# Altium project st-link-v2.PrjPCB
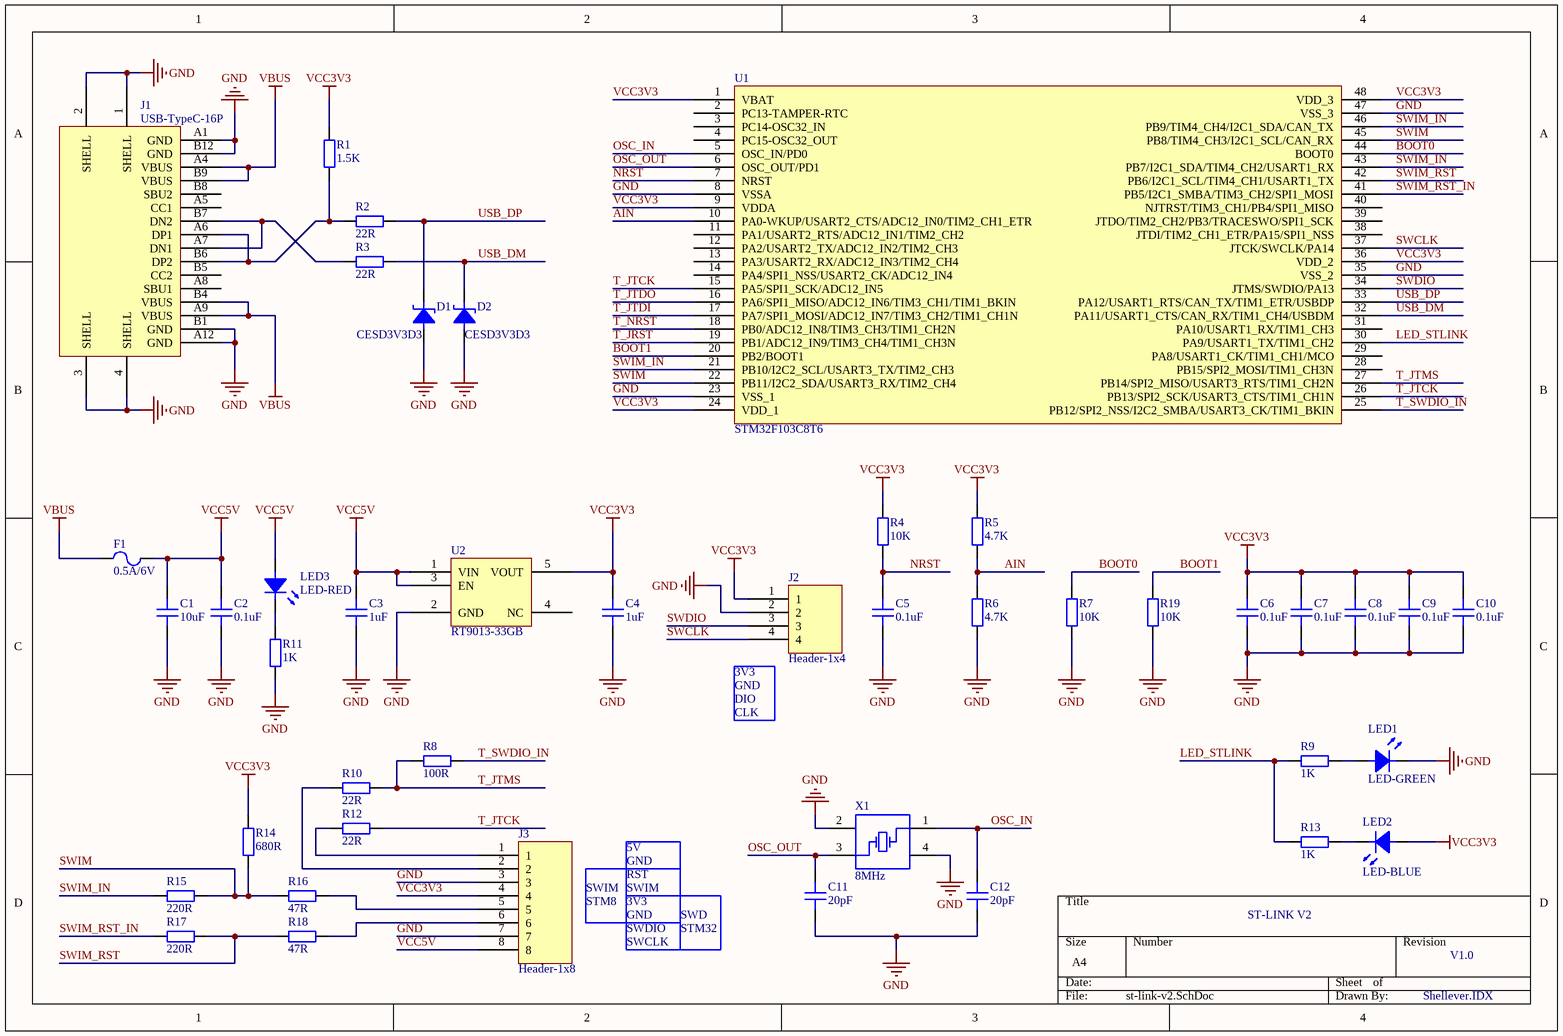
[diagram p0: st-link-v2.SchDoc]
1 sheet, 43 parts. Net scope: global (net labels, ports and power ports of the same name join across sheets).
Board file: st-link-v2.PcbDoc

## Sheet st-link-v2.SchDoc: ST-LINK V2
size A4; DrawnBy: Shellever.IDX; Revision: V1.0

### Parts
C1  10uF  [0603C]
C2  0.1uF  [0603C]
C3  1uF  [0603C]
C4  1uF  [0603C]
C5  0.1uF  [0603C]
C6  0.1uF  [0603C]
C7  0.1uF  [0603C]
C8  0.1uF  [0603C]
C9  0.1uF  [0603C]
C10  0.1uF  [0603C]
C11  20pF  [0603C]
C12  20pF  [0603C]
D1  CESD3V3D3  [SOD-323_L1.8-W1.3-LS2.5-RD]
D2  CESD3V3D3  [SOD-323_L1.8-W1.3-LS2.5-RD]
F1  0.5A/6V  [0603F]
J1  USB-TypeC-16P  [USB-C-SMD_KH-TYPE-C-16P]
J2  Header-1x4  [HDR-TH_4P-P2.54-V-M]
J3  Header-1x8  [HDR-TH_8P-P2.54-V-M]
LED1  LED-GREEN  [0603LED]
LED2  LED-BLUE  [0603LED]
LED3  LED-RED  [0603LED]
R1  1.5K  [0603R]
R2  22R  [0603R]
R3  22R  [0603R]
R4  10K  [0603R]
R5  4.7K  [0603R]
R6  4.7K  [0603R]
R7  10K  [0603R]
R8  100R  [0603R]
R9  1K  [0603R]
R10  22R  [0603R]
R11  1K  [0603R]
R12  22R  [0603R]
R13  1K  [0603R]
R14  680R  [0603R]
R15  220R  [0603R]
R16  47R  [0603R]
R17  220R  [0603R]
R18  47R  [0603R]
R19  10K  [0603R]
U1  STM32F103C8T6  [LQFP-48_L7.0-W7.0-P0.50-LS9.0-BL]
U2  RT9013-33GB  [SOT-23-5_L3.0-W1.7-P0.95-LS2.8-BR]
X1  8MHz  [OSC-SMD_3225-4P-L3.2-W2.5-BL]

### Nets
GND: C1.1 C2.1 C3.1 C4.1 C5.1 C6.1 C7.1 C8.1 C9.1 C10.1 C11.2 C12.1 D1.2(A) D2.2(A) J1.1(SHELL) J1.2(SHELL) J1.3(SHELL) J1.4(SHELL) J1.A1(GND) J1.A12(GND) J1.B1(GND) J1.B12(GND) J2.2 J3.3 J3.7 LED1.2(K) R6.1 R7.1 R11.1 R19.1 U1.8(VSSA) U1.23(VSS_1) U1.35(VSS_2) U1.47(VSS_3) U2.2(GND) X1.2(GND) X1.4(GND)
VBUS: F1.1 J1.A4(VBUS) J1.A9(VBUS) J1.B4(VBUS) J1.B9(VBUS)
VCC3V3: C4.2 C6.2 C7.2 C8.2 C9.2 C10.2 J2.1 J3.4 LED2.1(A) R1.2 R4.2 R5.2 R14.2 U1.1(VBAT) U1.9(VDDA) U1.24(VDD_1) U1.36(VDD_2) U1.48(VDD_3) U2.5(VOUT)
VCC5V: C1.2 C2.2 C3.2 F1.2 J3.8 LED3.1(A) U2.1(VIN) U2.3(EN)
AIN: R5.1 R6.2 U1.10(PA0-WKUP/USART2_CTS/ADC12_IN0/TIM2_CH1_ETR)
BOOT0: R7.2 U1.44(BOOT0)
BOOT1: R19.2 U1.20(PB2/BOOT1)
LED_STLINK: R9.2 R13.2 U1.30(PA9/USART1_TX/TIM1_CH2)
NRST: C5.2 R4.1 U1.7(NRST)
OSC_IN: C12.2 U1.5(OSC_IN/PD0) X1.1(OSC1)
OSC_OUT: C11.1 U1.6(OSC_OUT/PD1) X1.3(OSC2)
SWCLK: J2.4 U1.37(JTCK/SWCLK/PA14)
SWDIO: J2.3 U1.34(JTMS/SWDIO/PA13)
SWIM: R14.1 R15.1 R16.2 U1.22(PB11/I2C2_SDA/USART3_RX/TIM2_CH4) U1.45(PB8/TIM4_CH3/I2C1_SCL/CAN_RX)
SWIM_IN: R15.2 U1.21(PB10/I2C2_SCL/USART3_TX/TIM2_CH3) U1.43(PB7/I2C1_SDA/TIM4_CH2/USART1_RX) U1.46(PB9/TIM4_CH4/I2C1_SDA/CAN_TX)
SWIM_RST: R17.1 R18.2 U1.42(PB6/I2C1_SCL/TIM4_CH1/USART1_TX)
SWIM_RST_IN: R17.2 U1.41(PB5/I2C1_SMBA/TIM3_CH2/SPI1_MOSI)
T_JRST: U1.19(PB1/ADC12_IN9/TIM3_CH4/TIM1_CH3N)
T_JTCK: R12.1 U1.15(PA5/SPI1_SCK/ADC12_IN5) U1.26(PB13/SPI2_SCK/USART3_CTS/TIM1_CH1N)
T_JTDI: U1.17(PA7/SPI1_MOSI/ADC12_IN7/TIM3_CH2/TIM1_CH1N)
T_JTDO: U1.16(PA6/SPI1_MISO/ADC12_IN6/TIM3_CH1/TIM1_BKIN)
T_JTMS: R8.2 R10.1 U1.27(PB14/SPI2_MISO/USART3_RTS/TIM1_CH2N)
T_NRST: U1.18(PB0/ADC12_IN8/TIM3_CH3/TIM1_CH2N)
T_SWDIO_IN: R8.1 U1.25(PB12/SPI2_NSS/I2C2_SMBA/USART3_CK/TIM1_BKIN)
USB_DM: D2.1(K) R3.2 U1.32(PA11/USART1_CTS/CAN_RX/TIM1_CH4/USBDM)
USB_DP: D1.1(K) R2.2 U1.33(PA12/USART1_RTS/CAN_TX/TIM1_ETR/USBDP)
NetJ1_A6: J1.A6(DP1) J1.B6(DP2) R1.1 R2.1
NetJ1_A7: J1.A7(DN1) J1.B7(DN2) R3.1
NetJ3_1: J3.1 R12.2
NetJ3_2: J3.2 R10.2
NetJ3_5: J3.5 R16.1
NetJ3_6: J3.6 R18.1
NetLED1_1: LED1.1(A) R9.1
NetLED2_2: LED2.2(K) R13.1
NetLED3_2: LED3.2(K) R11.2

Not connected (* = marked no-connect by the designer): J1 A5(CC1) A8(SBU1) B5(CC2) B8(SBU2); U1 2(PC13-TAMPER-RTC) 3(PC14-OSC32_IN) 4(PC15-OSC32_OUT) 11(PA1/USART2_RTS/ADC12_IN1/TIM2_CH2) 12(PA2/USART2_TX/ADC12_IN2/TIM2_CH3) 13(PA3/USART2_RX/ADC12_IN3/TIM2_CH4) 14(PA4/SPI1_NSS/USART2_CK/ADC12_IN4) 28(PB15/SPI2_MOSI/TIM1_CH3N) 29(PA8/USART1_CK/TIM1_CH1/MCO) 31(PA10/USART1_RX/TIM1_CH3) 38(JTDI/TIM2_CH1_ETR/PA15/SPI1_NSS) 39(JTDO/TIM2_CH2/PB3/TRACESWO/SPI1_SCK) 40(NJTRST/TIM3_CH1/PB4/SPI1_MISO); U2 4(NC)

### Notes on the sheet
- (near J2) 3V3
- GND
- DIO
- CLK
- 5V
- SWIM
- STM8
- 3V3
- RST
- SWD
- SWCLK
- SWDIO
- STM32

### Library data of the parts
C1-C12 = CAP: Capacitor
D1 D2 = CESD3V3D3: Uni-direction ESD Protection Diode
F1 = Fuse
J1 = USB-TypeC-16P: USB Type C 16 Pin Female
J2 = Header-1x4: Header with 1x4 pins
J3 = Header-1x8: Header with 1x8 pins
LED1-LED3 = LED
R1-R19 = RES: Resistor
U1 = STM32F103x8_LQFP48: STM32F103x8 LQFP48
U2 = RT9013: 500mA LDO Regulator without Bypass Capacitor; Manufacturer: RICHTEK<https://tw.richtek.com/>; Contributor: Shellever.IDX<shellever@163.com>; Manufacturer Part: RT9013-33GB; Supplier: LCSC<https://www.szlcsc.com/>; Supplier Part: C47773; Footprint: SOT-23-5
X1 = XTAL-Crystal-MHz: passive crystal 8MHz